# EAGLE design HixCO2TemperatureIRBlaster (EAGLE 9.5.2)
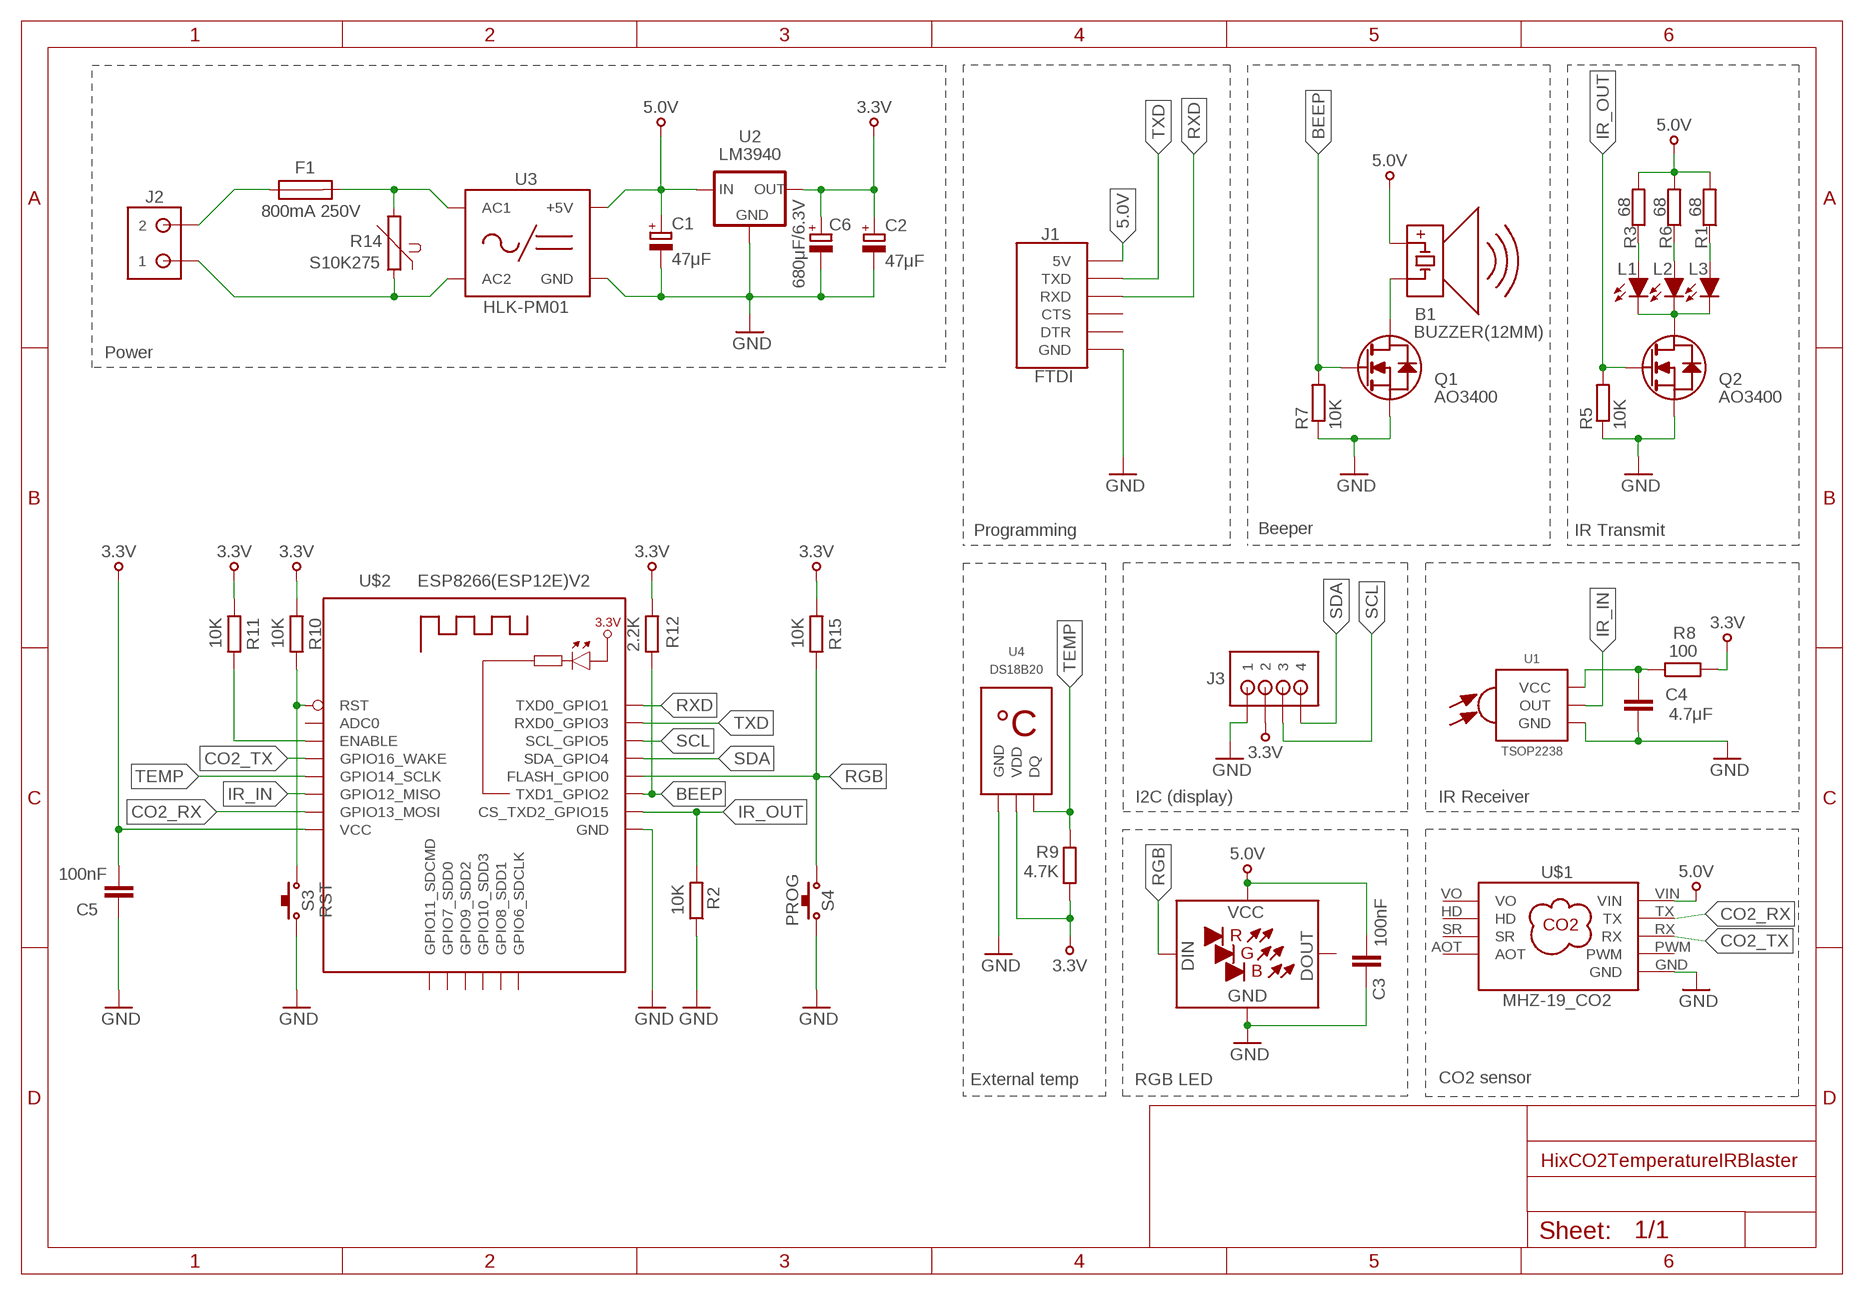
[diagram p0: schematic, sheet 1]

## Parts
B1  BUZZER(12MM)  [BUZZER(12MM)]
C1  47μF  CPOL-EUSMCA  [SMC_A]
C2  47μF  CPOL-EUSMCA  [SMC_A]
C3  100nF  C-EUC1206  [C1206]
C4  4.7μF  C-EUC1206  [C1206]
C5  100nF  C-EUC1206  [C1206]
C6  680μF/6.3V  ELCOELKO_RADIAL_STRAIGHT_4P_8D_9H  [ELKO_RADIAL_STRAIGHT_4P_8D_9H]
F1  800mA 250V  FUSE  [FUSE_508]
J1  FTDI  [FTDI]
J2  IEC320C8  [IEC320C8]
J3  XH4P  [XH4P]
L1  LEDLED5MM_ANGLED1  [LED5MM_ANGLED1]
L2  LEDLED5MM_ANGLED1  [LED5MM_ANGLED1]
L3  LEDLED5MM_ANGLED1  [LED5MM_ANGLED1]
Q1  AO3400  [SOT23]
Q2  AO3400  [SOT23]
R1  68  R-EU_0204/7  [0204/7]
R2  10K  R-EU_R1206  [R1206]
R3  68  R-EU_0204/7  [0204/7]
R5  10K  R-EU_R1206  [R1206]
R6  68  R-EU_0204/7  [0204/7]
R7  10K  R-EU_R1206  [R1206]
R8  100  R-EU_R1206  [R1206]
R9  4.7K  R-EU_R1206  [R1206]
R10  10K  R-EU_R1206  [R1206]
R11  10K  R-EU_R1206  [R1206]
R12  2.2K  R-EU_R1206  [R1206]
R14  S10K275  [S10K275]
R15  10K  R-EU_R1206  [R1206]
S3  RST  PUSHBTNSMALL  [SMDPUSHBTN_TYPE1]
S4  PROG  PUSHBTNSMALL  [SMDPUSHBTN_TYPE1]
U1  TSOP2238  [TSOP2238]
U2  LM3940  [SOT223]
U3  HLK-PM01  [HLK-PM01]
U4  DS18B20  [TO-92(123)]
U$1  MHZ-19_CO2  [MHZ-19_CO2]
U$2  ESP8266(ESP12E)V2  [ESP8266(ESP12E)]
U$3  LED_RGB  [LED_PL9823-F5]

## Nets
3.3V: C2.+ C5.1 C6.+ J3.2 R8.2 R9.2 R10.2 R11.2 R12.2 R15.2 U2.3(OUT) U4.3(VDD) U$2.VCC
5.0V: B1.+ C1.+ C3.1 J1.5V R1.2 R3.2 R6.2 U2.1(IN) U3.VO+(+5V) U$1.VIN U$3.VCC
AC2: J2.AC1 R14.1 U3.AC2
BEEP: Q1.1(G) R7.2 R12.1 U$2.GPIO2_TXD1(TXD1_GPIO2)
CO2_RX: U$1.TX U$2.GPIO13_MOSI
CO2_TX: U$1.RX U$2.GPIO16_WAKE
GND: C1.- C2.- C3.2 C4.2 C5.2 C6.- J1.GND J3.1 Q1.2(S) Q2.2(S) R2.1 R5.1 R7.1 S3.2 S4.2 U1.GND U2.2(GND) U2.4(GND) U3.VO-(GND) U4.1(GND) U$1.GND U$2.GND U$3.GND
IR_IN: U1.OUT U$2.GPIO12_MISO
IR_OUT: Q2.1(G) R2.2 R5.2 U$2.GPIO15_CS_TXD2(CS_TXD2_GPIO15)
N$1: F1.2 R14.2 U3.AC1
N$2: F1.1 J2.AC2
N$3: L1.CATHODE(C) L2.CATHODE(C) L3.CATHODE(C) Q2.3(D)
N$4: L2.ANODE(A) R6.1
N$5: B1.- Q1.3(D)
N$6: C4.1 R8.1 U1.VCC
N$7: R10.1 S3.1 U$2.RST
N$8: R11.1 U$2.ENABLE
N$9: L1.ANODE(A) R3.1
N$10: L3.ANODE(A) R1.1
RGB: R15.1 S4.1 U$2.GPIO0_FLASH(FLASH_GPIO0) U$3.DIN
RXD: J1.RXD U$2.GPIO1_TXD0(TXD0_GPIO1)
SCL: J3.3 U$2.GPIO5_SCL(SCL_GPIO5)
SDA: J3.4 U$2.GPIO4_SDA(SDA_GPIO4)
TEMP: R9.1 U4.2(DQ) U$2.GPIO14_SCLK
TXD: J1.TXD U$2.GPIO3_RXD0(RXD0_GPIO3)
Unconnected: J1.CTS J1.DTR U$1.AOT U$1.HD U$1.PWM U$1.SR U$2.ADC0 U$2.CPIO11_SDCMD(GPIO11_SDCMD) U$2.GPIO6_SDCLK U$2.GPIO7_SDD0 U$2.GPIO8_SDD1 U$2.GPIO9_SDD2 U$2.GPIO10_SDD3 U$3.DOUT

## Notes on the sheet
- Power
- Programming | Beeper | IR Transmit
- I2C (display) | IR Receiver
- External temp | RGB LED | CO2 sensor

## Power pins joined to a net without a drawn wire
VO: U$1.VO

## Library data of the parts
B1 = 0_HixField:BUZZER(12MM)
C1 C2 = rcl:CPOL-EU: POLARIZED CAPACITOR, European symbol; SPICEPREFIX: C
C3-C5 = rcl:C-EU: CAPACITOR, European symbol; SPICEPREFIX: C
C6 = 0_HixField:ELCO
F1 = 0_HixField:FUSE: FUSE Wickmann; OC_FARNELL: unknown; OC_NEWARK: unknown
J1 = 0_HixField:FTDI
J2 = 0_HixField:IEC320C8
J3 = 0_HixField:XH4P
L1-L3 = 0_HixField:LED
Q1 Q2 = 0_HixField:AO3400: P-Channel enchanced mode mosfet
R1-R3 R5-R12 R15 = rcl:R-EU_: RESISTOR, European symbol; SPICEPREFIX: R
R14 = 0_HixField:S10K275: VARISTOR
S3 S4 = 0_HixField:PUSHBTN
U1 = 0_HixField:TSOP2238: TSOP2238
U2 = 0_HixField:LM3940
U3 = 0_HixField:HLK-PM01
U4 = 0_HixField:DS18B20
U$1 = 0_HixField:MHZ-19_CO2
U$2 = 0_HixField:ESP8266(ESP12E)V2
U$3 = 0_HixField:LED_RGB

## Board
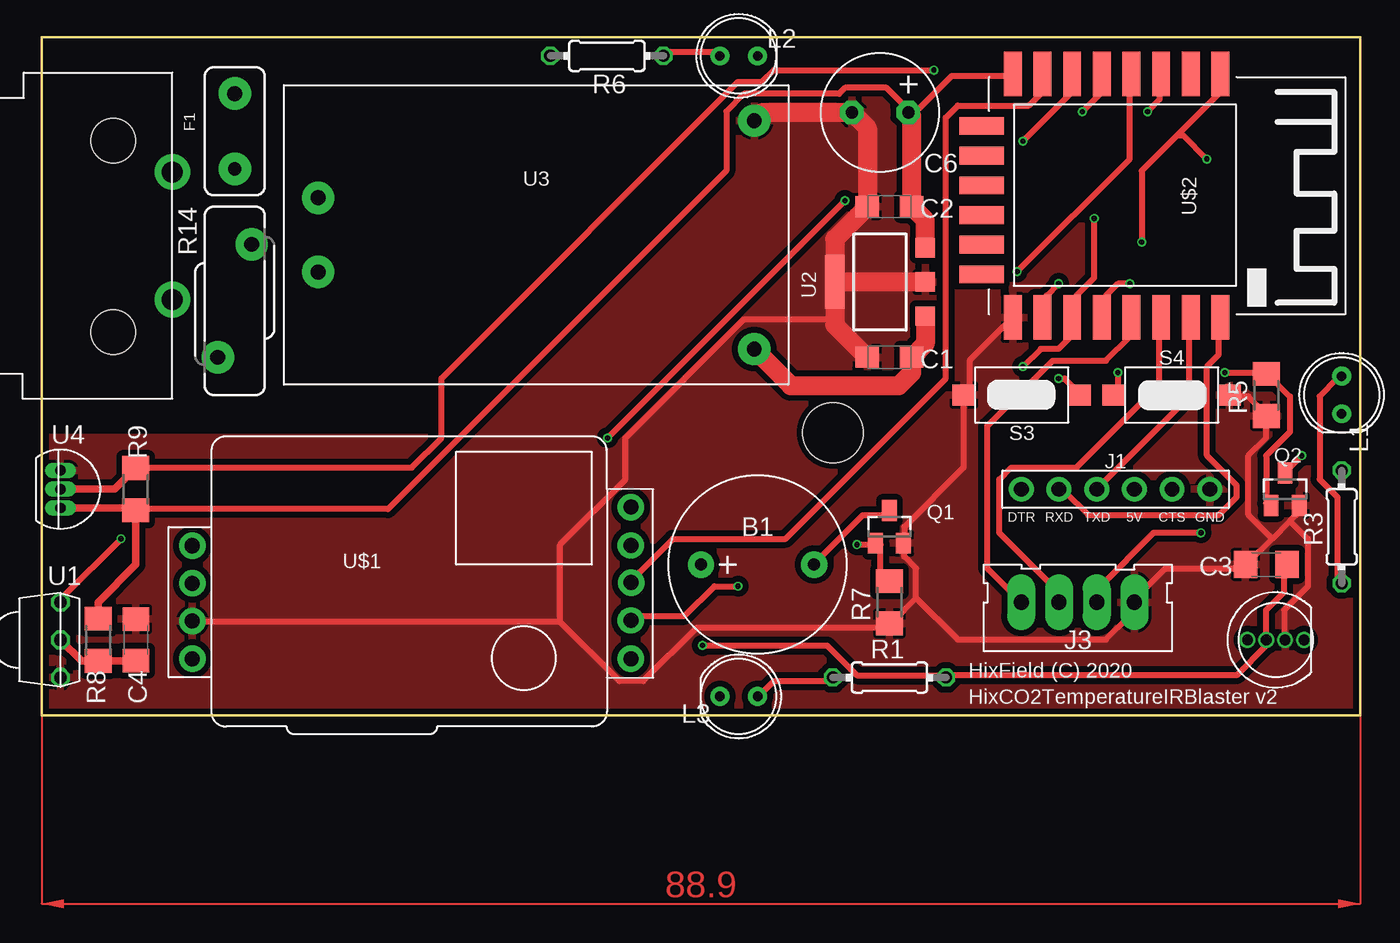
[diagram p1: board, top side]
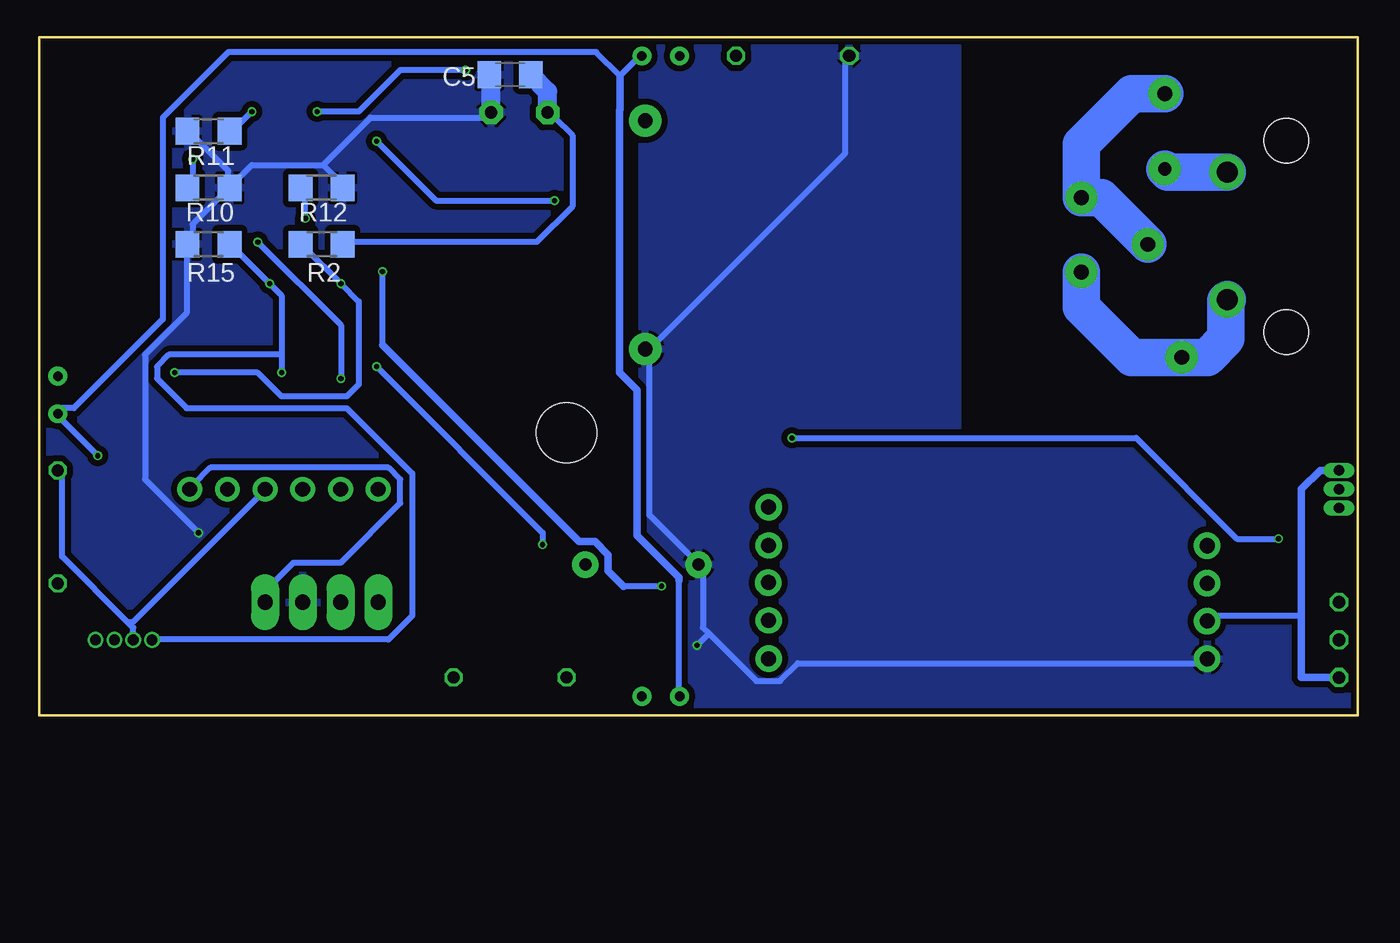
[diagram p2: board, bottom side, seen from below]

Size 88.9 x 45.72 mm. Coordinates in mm from the lower left corner, seen from the top.
Outline: 0,45.72 0,0 88.9,0 88.9,45.72 0,45.72
Copper layers (1*16): Top 0.018mm / dielectric 1.55mm / Bottom 0.018mm
Design rules "eC_2Layer_PClass6_BaseCopperO18_eCDefault *": minimum track width 0.4mm, minimum drill 0.35mm, track to track 0.4mm, track to pad 0.4mm, pad to pad 0.4mm, via to via 0.4mm, smd to smd 0mil, copper to edge 0.4mm, drill to drill 0.4mm, minimum pad ring 0.175mm, minimum via ring 0.125mm, stop-mask expansion 0mil, vias tented up to drill 0.45mm, thermal gap 0.2mm
Holes 4.06 mm at 53.34,19.05
tRestrict: area 0,19 to 26.7,45.7; area 81.3,26.7 to 88.9,45.7
bRestrict: area 0,19 to 26.7,45.7; area 81.3,26.7 to 88.9,45.7

### Footprints (pad centres in the part's own frame; a part is rotated, then mirrored left to right if it is on the bottom)
BUZZER(12MM) = drill 0.8 pad 1.778: + -3.81,0; - 3.81,0
SMC_A = smd 1.6 x 1.4: + -1.5,0; - 1.5,0
C1206 = smd 1.6 x 1.8: 1 -1.4,0; 2 1.4,0
ELKO_RADIAL_STRAIGHT_4P_8D_9H = drill 0.813 pad 1.6 octagon: + -1.27,0; - 2.54,0
FUSE_508 = drill 0.9 pad 2.184: 1 -2.54,0 | drill 1 pad 2.184: 2 2.54,0
FTDI = drill 1 pad 1.676: 5V 0,5.08; CTS 0,7.62; DTR 0,-2.54; GND 0,10.16; RXD 0,0; TXD 0,2.54
IEC320C8 = drill 1.4 pad 2.4: AC1 -5,-5; AC2 3.6,-5 | hole 3: -7.2,-1; 5.7,-1
XH4P = drill 1.016 pad 1.88 long: 1 0,2.54; 2 0,0; 3 0,-2.54; 4 0,-5.08
LED5MM_ANGLED1 = drill 0.65 pad 1.27: ANODE 0,0; CATHODE 2.54,0
SOT23 = smd 1 x 1.4: 1 -0.95,-1.1; 2 0.95,-1.1; 3 0,1.1
0204/7 = drill 0.813 octagon: 1 -3.81,0; 2 3.81,0
R1206 = smd 1.6 x 1.803: 1 -1.422,0; 2 1.422,0
S10K275 = drill 1 pad 2.184: 1 -1.143,-3.81; 2 1.143,3.81
SMDPUSHBTN_TYPE1 = smd 1.524 x 1.422: 1 -3.924,-0.051; 2 3.873,-0.051
TSOP2238 = drill 0.85 octagon: GND 0,-2.54; OUT -5.08,-2.54; VCC -2.54,-2.54
SOT223 = smd 1.3 x 1.3: 1 -2.3,-3.05; 2 0,-3.05; 3 2.3,-3.05 | smd 3.6 x 1.3: 4 0,3.05
HLK-PM01 = drill 1 pad 2.184: AC1 -14.7,2.5; AC2 -14.7,-2.5; VO+ 14.7,-7.7; VO- 14.7,7.7
TO-92(123) = drill 0.7 pad 1.016 long: 1 -1.27,0; 2 0,0; 3 1.27,0
MHZ-19_CO2 = drill 1.016 pad 1.778: AOT -8.89,3.81; GND -8.89,1.27; HD 20.67,8.95; PWM -8.89,6.35; RX 20.67,1.31; SR 20.67,6.37; TX 20.69,3.86; VIN -8.89,-1.27; VO 20.67,-1.27
ESP8266(ESP12E) = smd 3 x 1.2: ADC0 -8.3,3.8; ENABLE -8.3,1.8; GND 8.1,-8.2; GPIO0_FLASH 8.1,-2.2; GPIO1_TXD0 8.1,5.8; GPIO2_TXD1 8.1,-4.2; GPIO3_RXD0 8.1,3.8; GPIO4_SDA 8.1,-0.2; GPIO5_SCL 8.1,1.8; GPIO12_MISO -8.3,-4.2; GPIO13_MOSI -8.3,-6.2; GPIO14_SCLK -8.3,-2.2; GPIO15_CS_TXD2 8.1,-6.2; GPIO16_WAKE -8.3,-0.2; RST -8.3,5.8; VCC -8.3,-8.2 | smd 1.2 x 3: CPIO11_SDCMD -4.8,-10.3; GPIO6_SDCLK 5.2,-10.3; GPIO7_SDD0 -2.8,-10.3; GPIO8_SDD1 3.2,-10.3; GPIO9_SDD2 -0.8,-10.3; GPIO10_SDD3 1.2,-10.3
LED_PL9823-F5 = drill 0.711 pad 1.016: DIN -1.27,0; DOUT 2.54,0; GND 1.27,0; VCC 0,0

### Placement (x,y rotation side)
B1  48.26,10.16 0 top
C1  57.15,24.13 180 top
C2  57.15,34.29 180 top
C3  82.55,10.16 180 top
C4  6.35,5.08 90 top
C5  57.15,43.18 0 bottom
C6  57.15,40.64 180 top
F1  13.02,39.37 90 top
J1  68.58,15.24 270 top
J2  3.81,33.02 90 top
J3  71.12,7.62 270 top
L1  87.63,22.86 270 top
L2  45.72,44.45 0 top
L3  48.26,1.27 180 top
Q1  57.15,12.7 0 top
Q2  83.82,15.24 0 top
R1  57.15,2.54 0 top
R2  69.85,31.75 180 bottom
R3  87.63,12.7 90 top
R5  82.55,21.59 90 top
R6  38.1,44.45 180 top
R7  57.15,7.62 90 top
R8  3.81,5.08 90 top
R9  6.35,15.24 270 top
R10  77.47,35.56 0 bottom
R11  77.47,39.37 180 bottom
R12  69.85,35.56 0 bottom
R14  13.02,27.94 0 top
R15  77.47,31.75 180 bottom
S3  66.04,21.54 180 top
S4  76.2,21.64 0 top
U1  3.81,2.54 270 top
U2  56.52,29.21 90 top
U3  33.34,32.38 0 top
U4  1.27,15.24 270 top
U$1  19.05,5.08 0 top
U$2  73.66,34.92 270 top
U$3  82.55,5.08 0 top

### Tracks (layer width: path | path; a pad name or v marks a point on that pad's centre or on a via)
3.3V  (via drill 0.35)
  Top 0.4: U$2.VCC 65.35,43.1 61.35,43.1 58.95,40.7 C6.+ 58.15,41.1 56.95,42.3 54.15,42.3 53.75,41.9 47.35,41.9 46.15,40.7 46.15,36.7 23.35,13.9 6.55,13.9 R9.2 | v78.15,12.3 74.95,12.3 71.35,8.7 71.35,7.9 J3.2
  Top 0.5: U4.3 6.35,13.97 R9.2 6.35,10.16 3.81,7.62 R8.2
  Top 1.27: C6.+ 58.65,40.41 C2.+ 59.56,33.38 U2.3
  Bottom 0.4: 69.75,37.1 68.55,35.9 R12.2 | 69.75,37.1 74.55,37.1 75.75,35.9 R10.2 | R10.2 76.15,35.5 78.55,33.1 78.55,31.9 R15.2 78.95,31.5 78.95,27.1 81.75,24.3 81.75,15.9 v78.15,12.3 | R11.2 78.55,39.1 76.15,36.7 76.15,35.9 R10.2 | 69.75,37.1 66.55,40.3 58.95,40.3 C6.+
  Bottom 1.27: C6.+ 58.42,43.05 C5.1
  pour Bottom: 51.05,45.72 89.15,45.72 89.15,0 51.05,0
5.0V  (via drill 0.35)
  Top 0.4: C3.1 83.75,9.9 83.75,8.3 82.55,7.1 U$3.VCC 82.55,4.7 80.55,2.7 61.35,2.7 R1.2 60.95,2.7 54.95,2.7 52.95,4.7 v44.55,4.7
  Top 1.27: U3.VO+ 50.5,22.22 57.78,22.22 58.65,23.09 C1.+ 59.56,25.04 U2.1
  Bottom 0.4: 82.95,6.3 82.55,5.9 U$3.VCC | 82.95,6.3 87.35,10.7 87.35,16.3 R3.2 | 82.95,6.3 82.55,6.3 73.75,15.1 J1.5V | R6.2 34.55,44.3 34.55,37.9 47.75,24.7 U3.VO+ 47.75,24.3 47.75,13.5 44.55,10.3 B1.+ 44.15,9.9 44.15,5.9 43.75,5.5 | 43.75,5.5 40.55,2.3 38.95,2.3 37.75,3.5 10.55,3.5 U$1.VIN | 43.75,5.5 v44.55,4.7
  pour Bottom: 0,45.72 48.26,45.72 48.26,0 0,0
AC2
  Bottom 2.54: J2.AC1 8.89,27.94 8.89,25.4 10.16,24.13 R14.1 15.24,24.13 18.64,27.53 U3.AC2
BEEP  (via drill 0.35)
  Top 0.4: R7.2 56.95,9.1 56.55,9.5 56.55,11.5 Q1.1 56.15,11.5 v54.95,11.5 | v70.95,33.5 70.95,29.5 69.75,28.3 69.75,27.1 U$2.GPIO2_TXD1 69.35,26.7 69.35,25.5 68.55,24.7 67.35,24.7 v66.15,23.5
  Bottom 0.4: v70.95,33.5 70.95,35.5 R12.1 | v54.95,11.5 54.95,12.3 v66.15,23.5
CO2_RX
  Top 0.4: U$2.GPIO13_MOSI 67.35,43.1 67.35,41.9 66.55,41.1 61.75,41.1 60.95,40.3 60.95,22.7 50.15,11.9 42.55,11.9 39.75,9.1 U$1.TX
CO2_TX  (via drill 0.35)
  Top 0.4: v65.75,29.9 73.35,37.5 73.35,43.1 U$2.GPIO16_WAKE | v46.95,8.7 45.35,8.7 43.35,6.7 39.75,6.7 U$1.RX
  Bottom 0.4: 65.75,24.96 v65.75,29.9 | v46.95,8.7 49.49,8.7
  Bottom 0.5: 49.49,8.7 50.53,9.74 50.53,10.8 51.43,11.7 52.49,11.7 65.75,24.96
GND
  Top 0.4: S4.2 80.15,21.5 81.35,21.5 82.55,20.3 R5.1 82.55,18.7 81.35,17.5 81.35,13.5 82.95,11.9 | 82.95,11.9 81.35,10.3 C3.2 80.95,9.9 75.75,9.9 73.75,7.9 J3.1 73.35,7.5 73.35,6.7 71.75,5.1 61.75,5.1 58.95,7.9 | 82.95,11.9 84.15,13.1 | 84.15,13.1 84.55,13.5 84.55,13.9 Q2.2 | 84.15,13.1 85.35,11.9 85.35,8.7 83.75,7.1 83.75,5.1 U$3.GND | 58.95,7.9 58.95,9.9 58.15,10.7 58.15,11.5 Q1.2 58.15,11.9 58.15,12.7 62.15,16.7 62.15,21.5 S3.2 62.55,21.9 62.55,23.9 65.35,26.7 U$2.GND | 58.95,7.9 57.35,6.3 R7.1 56.95,5.9 44.15,5.9 40.55,2.3 38.95,2.3 34.95,6.3 | 34.95,6.3 10.55,6.3 U$1.GND | 53.46,26.7 47.35,26.7 39.35,18.7 39.35,15.9 34.95,11.5 34.95,6.3
  Top 1.27: U3.VO- 48.59,40.64 C6.- 55.65,39.6 C2.- 53.46,32.1 U2.4 | U2.4 53.46,26.7 53.46,26.31 C1.- | U2.2 U2.4
  Bottom 0.4: J1.GND 78.55,15.5 77.35,16.7 65.35,16.7 64.55,15.9 64.55,14.3 68.55,10.3 71.75,10.3 73.35,8.7 73.35,7.9 J3.1 | R2.1 68.15,31.9 55.35,31.9 52.95,34.3 52.95,39.1 54.15,40.3 C6.- | U$1.GND 10.15,6.7 3.81,6.7 3.75,6.7
  Bottom 0.5: U4.1 2.54,16.51 3.81,15.24 3.81,6.7 3.81,2.54 U1.GND
  Bottom 1.27: C6.- 54.61,42.04 C5.2
  pour Top: 0,45.72 88.9,45.72 88.9,0 0,0
IR_IN  (via drill 0.35)
  Top 0.4: v5.35,11.9 1.35,7.9 U1.OUT | v54.15,34.7 v38.15,18.7 | v66.15,38.7 69.35,41.9 69.35,43.1 U$2.GPIO12_MISO
  Bottom 0.4: v5.35,11.9 8.15,11.9 14.95,18.7 v38.15,18.7 | v54.15,34.7 62.15,34.7 v66.15,38.7
IR_OUT  (via drill 0.35)
  Top 0.4: 82.55,23.1 84.15,21.5 84.15,19.1 82.55,17.5 82.55,14.3 Q2.1 | v68.55,29.1 67.75,28.3 67.75,27.1 U$2.GPIO15_CS_TXD2 | v79.75,23.1 82.55,23.1 | 82.55,23.1 R5.2
  Bottom 0.4: R2.2 70.95,31.5 v68.55,29.1 67.35,27.9 67.35,22.3 68.15,21.5 72.55,21.5 74.15,23.1 v79.75,23.1
N$1
  Bottom 2.54: R14.2 17.29,34.88 U3.AC1 18.64,38.51 15.24,41.91 F1.2
N$2
  Bottom 2.54: J2.AC2 12.81,36.62 F1.1
N$3  (via drill 0.35)
  Top 0.4: v84.95,17.5 84.15,16.7 Q2.3
  Bottom 0.4: v84.95,17.5 87.75,20.3 L1.CATHODE 87.35,20.7 86.55,20.7 80.55,26.7 80.55,40.3 76.15,44.7 51.35,44.7 49.75,43.1 48.55,44.3 L2.CATHODE | 45.75,9.1 45.75,1.5 L3.CATHODE
  Bottom 0.5: 45.75,9.1 45.75,9.28 48.6,12.13 48.6,21.93 49.78,23.11 49.78,40.81 49.75,40.84 49.75,43.1
N$4
  Top 0.4: R6.1 42.15,44.7 45.35,44.7 L2.ANODE
N$5
  Top 0.4: Q1.3 56.95,13.5 55.35,13.5 52.15,10.3 B1.-
N$6
  Top 0.4: 3.61,3.9 R8.1
  Top 0.5: C4.1 6.33,3.66 R8.1 2.69,3.66 U1.VCC
N$7  (via drill 0.35)
  Top 0.4: v68.55,22.7 68.95,22.7 69.75,21.9 S3.1 | v74.15,31.9 74.15,36.7 76.55,39.1 | 76.55,39.1 79.35,41.9 79.35,43.1 U$2.RST | v78.55,37.5 76.95,39.1 76.55,39.1
  Bottom 0.4: v68.55,22.7 68.55,26.3 v74.15,31.9 | v78.55,37.5 78.55,35.9 R10.1
N$8  (via drill 0.35)
  Top 0.4: v74.55,40.7 75.35,41.5 75.35,43.1 U$2.ENABLE
  Bottom 0.4: v74.55,40.7 75.75,39.5 R11.1
N$9
  Top 0.4: R3.1 87.35,9.1 87.35,14.7 86.15,15.9 86.15,21.5 87.35,22.7 L1.ANODE
N$10
  Top 0.4: R1.1 52.95,2.3 49.35,2.3 48.55,1.5 L3.ANODE
RGB  (via drill 0.35)
  Top 0.4: v72.55,23.1 72.55,21.9 S4.1 | v73.35,29.1 72.55,29.1 71.75,28.3 71.75,27.1 U$2.GPIO0_FLASH
  Bottom 0.4: 72.55,24.3 72.55,28.3 v73.35,29.1 75.75,31.5 R15.1 | 72.55,24.3 v72.55,23.1 | 72.55,24.3 80.15,24.3 80.95,23.5 80.95,22.7 78.95,20.7 68.15,20.7 63.75,16.3 63.75,6.7 65.35,5.1 80.95,5.1 U$3.DIN
RXD
  Top 0.4: U$2.GPIO1_TXD0 79.35,26.7 79.35,24.3 78.55,23.5 78.55,17.5 80.55,15.5 80.55,14.7 79.35,13.5 70.55,13.5 68.95,15.1 J1.RXD
SCL
  Top 0.4: U$2.GPIO5_SCL 75.35,26.7 75.35,22.3 69.75,16.7 65.35,16.7 64.55,15.9 64.55,12.3 68.95,7.9 J3.3
SDA
  Top 0.4: U$2.GPIO4_SDA 73.35,26.7 73.35,25.5 71.75,23.9 68.15,23.9 63.75,19.5 63.75,9.9 65.75,7.9 J3.4
TEMP  (via drill 0.35)
  Top 0.4: v70.15,40.7 71.35,41.9 71.35,43.1 U$2.GPIO14_SCLK | v60.15,43.5 49.35,43.5 48.55,42.7 46.95,42.7 26.95,22.7 26.95,18.7 24.95,16.7 6.55,16.7 R9.1
  Top 0.5: R9.1 4.93,15.24 U4.2
  Bottom 0.4: v70.15,40.7 67.35,40.7 64.55,43.5 v60.15,43.5
TXD
  Top 0.4: U$2.GPIO3_RXD0 77.35,26.7 77.35,21.5 71.35,15.5 J1.TXD
(copper drawn outside any net)
  shapes: Top area x1

### Text on the board
tPlace: HixField (C) 2020 | HixCO2TemperatureIRBlaster v2